# Altium schematic sheet SOUP_USB.SchDoc
size 558 x 431 mm; SheetNumber: 4; SheetTotal: 4
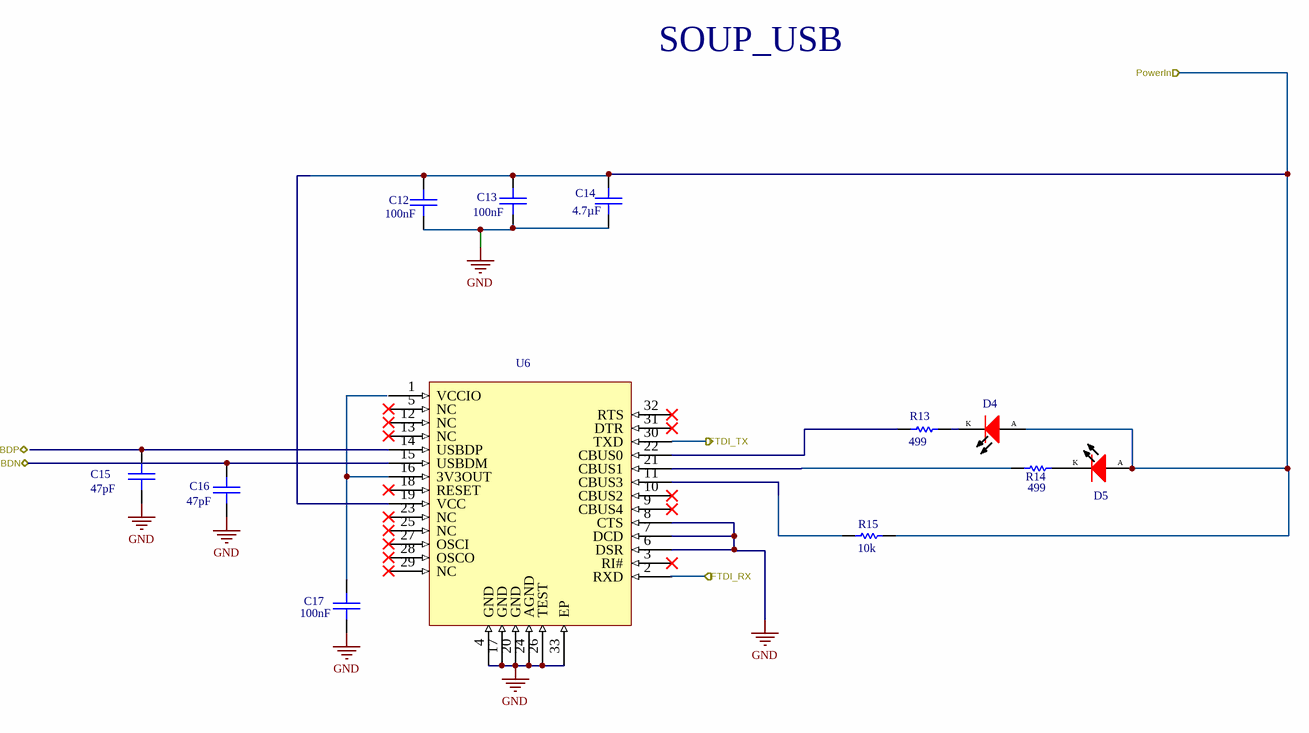
[diagram p0: SOUP_USB.SchDoc]

## Parts
C12  value 100nF  [CAP-0402-A]  (hidden comment: Cap 0402 0.1uf 25V 10% X7R)
C13  value 100nF  [CAP-0402-A]  (hidden comment: Cap 0402 0.1uf 25V 10% X7R)
C14  value 4.7µF  [CAP-0402-A]  (hidden comment: CAP 0402 4.7uF 6.3V 10% X5R)
C15  value 47pF  [CAP-0402-A]  (hidden comment: CAP 0402 47pF 50V 5% C0G/NP0)
C16  value 47pF  [CAP-0402-A]  (hidden comment: CAP 0402 47pF 50V 5% C0G/NP0)
C17  value 100nF  [CAP-0402-A]  (hidden comment: Cap 0402 0.1uf 25V 10% X7R)
D4  APT2012SECK/J3-PRV  [LED-0805-G-A]  (value not drawn)
D5  APT2012SECK/J3-PRV  [LED-0805-G-A]  (value not drawn)
R13  value 499  [RES-0402-A]  (hidden comment: RES 0402 499 OHM 1/10W 1%)
R14  value 499  [RES-0402-A]  (hidden comment: RES 0402 499 OHM 1/10W 1%)
R15  value 10k  [RES-0402-A]  (hidden comment: RES 0402 10K 1/10W 1%)
U6  FT232RNQ  [IC-QFN32-A]  (value not drawn)

## Ports
FTDI_RX (in), FTDI_TX (out), PowerIn (in), USBDN (bidir), USBDP (bidir)

## Nets
GND: C12.1 C13.1 C14.1 C15.1 C16.1 C17.1 U6.4(GND) U6.6(DSR) U6.7(DCD) U6.8(CTS) U6.17(GND) U6.20(GND) U6.24(AGND) U6.26(TEST) U6.33(EP)
FTDI_RX: U6.2(RXD) ; port FTDI_RX
FTDI_TX: U6.30(TXD) ; port FTDI_TX
PowerIn: C12.2 C13.2 C14.2 D4.A D5.A R15.1 U6.19(VCC) ; port PowerIn
USBDN: C16.2 U6.15(USBDM) ; port USBDN
NetC15_2: C15.2 U6.14(USBDP)
NetC17_2: C17.2 U6.16(3V3OUT)
NetD4_K: D4.K R13.2
NetD5_K: D5.K R14.2
NetR13_1: R13.1 U6.22(CBUS0)
NetR14_1: R14.1 U6.21(CBUS1)
NetR15_2: R15.2 U6.11(CBUS3)

Not connected (* = marked no-connect by the designer): U6 1(VCCIO) 3(RI#)* 5(NC)* 9(CBUS4)* 10(CBUS2)* 12(NC)* 13(NC)* 18(RESET)* 23(NC)* 25(NC)* 27(OSCI)* 28(OSCO)* 29(NC)* 31(DTR)* 32(RTS)*

## Notes on the sheet
- SOUP_USB
- REVISIONS
- REVISION
- DESCRIPTION
- DATE(YEAR-MO-DA)
- APPROVED
- DWG NO
- SH
- THIS DRAWING IS CAD MAINTAINED.
  CHANGES SHALL BE INCORPORATED
  BY THE DESIGN ACTIVITY.
- PART NO.
- CONTRACT NUMBER
- DESIGN ACTIVITY
- CONTRACTOR
- US ARMY
  COMBAT CAPABILITIES DEVELOPMENT COMMAND ARMAMENTS CENTER
  PICATINNY ARSENAL, NEW JERSEY 07806-5000
- DRAWN BY
- ENGINEER
- CHECKER
- QUALITY ENGINEER
- DRAWING APPROVAL
- SIZE
- CAGE CODE
- DWG NO.
- NEXT ASSY
- USED ON
- DESIGN APPROVAL
- C
- 19200
- APPLICATION
- SCALE
- NONE
- UNIT WT.
- ---
- SHEET

## Library data of the parts
C12 C13 C17 = CAP-00172-4: Multilayer Ceramic Capacitor, 0.1 uF, 25 V, ± 10%, X7R, 0402 [1005 Metric]; Leader Qty: 100; Case/Package: 0402; Max Operating Temperature: 125°C; Min Operating Temperature: -55°C; Mounting Technology: Surface Mount; Ratings: AEC-Q200; Reach SVHC Compliant: No; RoHS Compliant: Yes; Series: CGA; Termination: SMD/SMT; Tolerance: 10%; Voltage: 25V; Voltage Rating (DC): 25V; Voltage Rating: 25V
C14 = CAP-00128-6: Cap Ceramic 4.7uF 6.3V JB 10% SMD 0402 85°C Punched Paper T/R; Leader Qty: 100; Case/Package: 0402; Max Operating Temperature: 85°C; Min Operating Temperature: -25°C; RoHS Compliant: Yes; Tolerance: 10%; Voltage Rating: 6.3V
C15 C16 = CAP-00400-2: Leader Qty: 100; UOM: EA; Case/Package: 0402; Max Operating Temperature: 150°C; Min Operating Temperature: -55°C; Mounting Technology: Surface Mount; Tolerance: 5%; Voltage Rating: 50V
D4 D5 = CMP-00740-1: Red 625nm LED Indication - Discrete 2.2V 0805; Manufacturer Package Identifier: 0805 (2012 metric); Forward Current: 30mA; Lens Color: Colorless; Lens Transparency: Clear; Luminous Intensity: 1.1cd; Number of Circuits: 1; Peak Wavelength: 640nm; Shape: Rectangular; Test Current: 20mA; Viewing Angle: 120°; Case/Package: 0805; Case Code (Imperial): 0805; Case Code (Metric): 2012; China RoHS: Compliant; Color: Red; Country of Origin: Mainland China; Dominant Wavelength: 625nm; Forward Voltage: 2.2V; Harmonized Tariff Schedule (HTS) Code: 8541.40.20.00; Height: 750µm; Illumination Color: Red; Introduction Date: 2015-05-05; Lead Free: Lead Free; Length: 2mm; Lifecycle Status: Production; Max Operating Temperature: 85°C; Min Operating Temperature: -40°C; Mounting Technology: Surface Mount; Number of Terminals: 2; Packaging: Tape & Reel (TR); REACH SVHC: Yes; RoHS: Compliant; Schedule B: 8541402000, 8541402000; Terminal Pitch: 2.35mm; Width: 1.25mm
R13 R14 = RES-00802-1: Leader Qty: 100; UOM: EA; Voltage Rating: 50V; Case/Package: 0402; Max Operating Temperature: 155°C; Min Operating Temperature: -55°C; Mounting Technology: Surface Mount; Tolerance: 1%
R15 = RES-00803-1: Leader Qty: 100; UOM: EA; Voltage Rating: 75V; Case/Package: 0402; Max Operating Temperature: 155°C; Min Operating Temperature: -55°C; Mounting Technology: Surface Mount; Tolerance: 1%
U6 = IC-00470-3: USB Bridge, USB to UART USB 2.0 UART Interface 32-QFN (5x5); Clock Frequency: 12.02MHz; Data Rate: 60Mbps; Max Supply Voltage: 5.25V; Min Supply Voltage: 3.3V; Height - Seated (Max): 900µm; Interface: UART; Length: 5mm; Lifecycle Status: Production; Max Operating Temperature: 85°C; Min Operating Temperature: -40°C; Number of Terminals: 32; REACH SVHC: Yes; RoHS: Compliant; Terminal Pitch: 500µm; Width: 5mm; Case/Package: QFN32